# Altium schematic sheet power_supply.SchDoc
size A4; DocumentNumber: 1; SheetNumber: 1; SheetTotal: 2
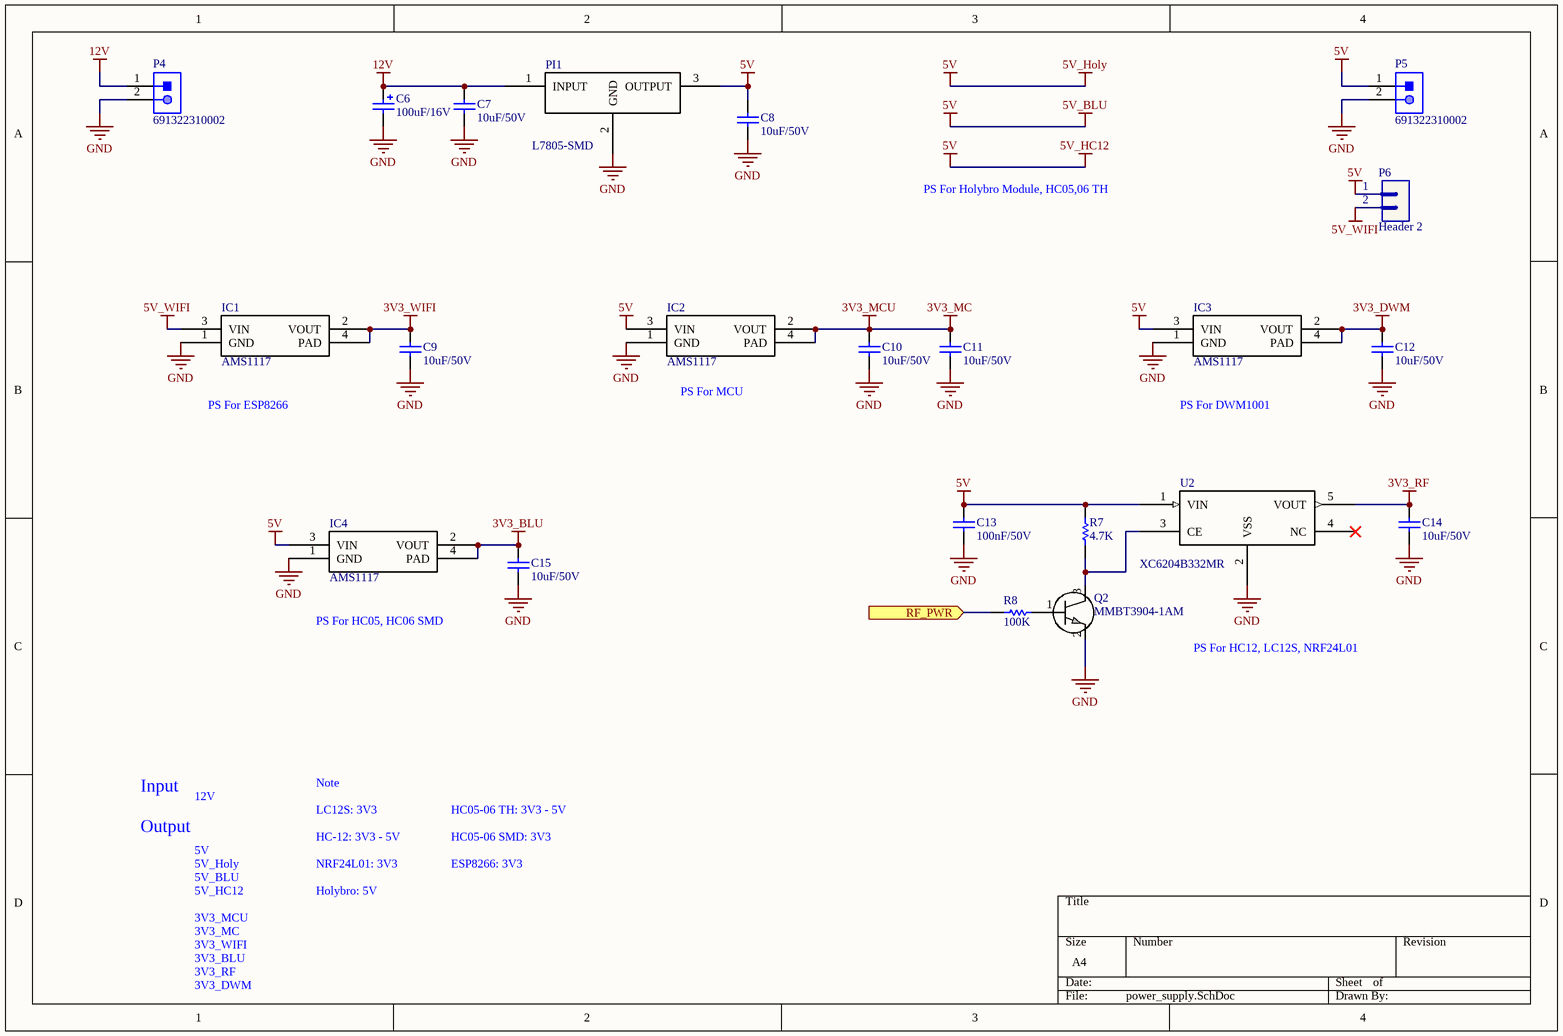
[diagram p0: power_supply.SchDoc]

## Parts
C6  value 100uF/16V  [CAP-SM-AL-SIZE-D-D6L6]  (hidden comment: Cap-Al-100uF-16V-D6L5)
C7  value 10uF/50V  [CAP-SM-0805]  (hidden comment: Cap-10uF-50V-0805)
C8  value 10uF/50V  [CAP-SM-0805]  (hidden comment: Cap-10uF-50V-0805)
C9  value 10uF/50V  [CAP-SM-0805]  (hidden comment: Cap-10uF-50V-0805)
C10  value 10uF/50V  [CAP-SM-0805]  (hidden comment: Cap-10uF-50V-0805)
C11  value 10uF/50V  [CAP-SM-0805]  (hidden comment: Cap-10uF-50V-0805)
C12  value 10uF/50V  [CAP-SM-0805]  (hidden comment: Cap-10uF-50V-0805)
C13  value 100nF/50V  [CAP-SM-0805]  (hidden comment: Cap-100nF-50V-0805)
C14  value 10uF/50V  [CAP-SM-0805]  (hidden comment: Cap-10uF-50V-0805)
C15  value 10uF/50V  [CAP-SM-0805]  (hidden comment: Cap-10uF-50V-0805)
IC1  AMS1117  [SOT223_AMS111700]
IC2  AMS1117  [SOT223_AMS111700]
IC3  AMS1117  [SOT223_AMS111700]
IC4  AMS1117  [SOT223_AMS111700]
P4  691322310002  [691322310002]
P5  691322310002  [691322310002]
P6  Header 2  [JP2]
PI1  L7805-SMD  [D2PAK]
Q2  MMBT3904-1AM  [SOT23_NEX]
R7  value 4.7K  [RES-SM-0805]  (hidden comment: Res-4.7K-0805)
R8  value 100K  [RES-SM-0805]  (hidden comment: Res-100K-0805)
U2  XC6204B332MR  [XC6204/05_SOT-25]

## Ports
RF_PWR (in)

## Nets
3V3_BLU: C15.2 IC4.2(VOUT) IC4.4(PAD)
3V3_DWM: C12.2 IC3.2(VOUT) IC3.4(PAD)
3V3_MC: C10.2 C11.2 IC2.2(VOUT) IC2.4(PAD)  [also labelled 3V3_MCU]
3V3_RF: C14.2 U2.5(VOUT)
3V3_WIFI: C9.2 IC1.2(VOUT) IC1.4(PAD)
5V: C8.2 C13.2 IC2.3(VIN) IC3.3(VIN) IC4.3(VIN) P5.1 P6.1 PI1.3(OUTPUT) R7.2 U2.1(VIN)  [also labelled 5V_BLU, 5V_HC12, 5V_Holy]
5V_WIFI: IC1.3(VIN) P6.2
12V: C6.1 C7.2 P4.1 PI1.1(INPUT)
GND: C6.2 C7.1 C8.1 C9.1 C10.1 C11.1 C12.1 C13.1 C14.1 C15.1 IC1.1(GND) IC2.1(GND) IC3.1(GND) IC4.1(GND) P4.2 P5.2 PI1.2(GND) Q2.2 U2.2(VSS)
RF_PWR: R8.1 ; port RF_PWR
NetQ2_1: Q2.1 R8.2
NetQ2_3: Q2.3 R7.1 U2.3(CE)

Not connected (* = marked no-connect by the designer): U2 4(NC)*

## Notes on the sheet
- PS For Holybro Module, HC05,06 TH
- PS For ESP8266
- (near IC2) PS For MCU
- PS For DWM1001
- PS For HC05, HC06 SMD
- PS For HC12, LC12S, NRF24L01
- Note
- Input
- Output
- 12V
- LC12S: 3V3
- HC-12: 3V3 - 5V
- HC05-06 TH: 3V3 - 5V
- HC05-06 SMD: 3V3
- 5V
  5V_Holy
  5V_BLU
  5V_HC12
- NRF24L01: 3V3
- Holybro: 5V
- ESP8266: 3V3
- 3V3_MCU
  3V3_MC
  3V3_WIFI
  3V3_BLU
  3V3_RF
  3V3_DWM

## Library data of the parts
C6 = Cap-Al-100uF-16V-D6L5: CAP ALUM 100UF 20% 16V SMD; Manufacturer: Nichicon; Manufacturer Part Number: UWX1C101MCL1GB; Local Supplier: thegioiic; Local Supplier Link: https://thegioiic.com/products/tu-nhom-smd-100uf-16v-d6-3l5-4; Supplier 1: Digikey; Supplier 1 Part Number: 493-2105-1-ND; Supplier 1 Link: https://www.digikey.com/product-detail/en/nichicon/UWX1C101MCL1GB/493-2105-1-ND/590080
C7-C12 C14 C15 = Cap-10uF-50V-0805: CAP CER 10UF 50V X5R 0805; Manufacturer: Yageo; Manufacturer Part Number: CC0805KKX5R9BB106; Local Supplier: thegioiic; Local Supplier Link: https://thegioiic.com/products/tu-10uf-50v-0805; Supplier 1: Digikey; Supplier 1 Link: https://www.digikey.com/product-detail/en/yageo/CC0805KKX5R9BB106/311-3499-2-ND/7164383; Supplier 1 Part Number: 311-3499-2-ND
C13 = Cap-100nF-50V-0805: CAP CER 0.1UF 50V Y5V 0805; Manufacturer: Samsung Electro-Mechanics; Manufacturer Part Number: CL21F104ZBCNNNC; Local Supplier: thegioiic; Local Supplier Link: https://thegioiic.com/products/tu-100nf-0-1uf-50v-0805; Supplier 1: Digikey; Supplier 1 Part Number: 1276-1007-1-ND; Supplier 1 Link: https://www.digikey.com/product-detail/en/samsung-electro-mechanics/CL21F104ZBCNNNC/1276-1007-1-ND/3889093
IC1-IC4 = AMS1117: Manufacturer_Part_Number: AMS1117-5.0; SourceLibrary: Advanced_Monolithic_Systems_2020-02-13; Built_By: EMA_Kyle; Vendor: Advanced Monolithic Systems; Copyright: Copyright (C) 2018 Accelerated Designs. All rights reserved; RefDes: RefDes; Type: DEV
P4 P5 = 691322310002: WR-TBL Serie 322 Horizontal PCB Header, Pluggable, pitch 3.81mm, 2p; Compliance: RoHS; Modularity: No; Pin Number: 2; Rated Current [UL]: 10A; Working Voltage [UL]: 300VAC; ComponentLink1Description: Manufacturer; ComponentLink1URL: http://www.we-online.de; ComponentLink2URL: https://katalog.we-online.de/em/datasheet/691322310002.pdf; ComponentLink2Description: Datasheet; Mounting Technology: THT; Part Number: 691322310002; Packaging: Box; Operating Temperature: -40 to +105degC; PCB/Cable/Panel: PCB; Pitch: 3.81mm; Published Date: October 2019; Type: Horizontal; Publisher: Wurth Elektronik; Application: Pluggable
P6 = Header 2: Header, 2-Pin; LatestRevisionDate: 17-Jul-2002; LatestRevisionNote: Re-released for DXP Platform.; Publisher: Altium Limited
PI1 = L7805-SMD: Manufacturer_Part_Number: L7805CD2T-TR; Vendor: STMicroelectronics; Built_By: EMA_UL_Team; Copyright: Copyright (C) 2018 Accelerated Designs. All rights reserved; RefDes: RefDes; Type: DEV
Q2 = MMBT3904-1AM: Vendor: Nexperia; SourceLibrary: Nexperia_2018-05-2018; Type: DEV; Manufacturer_Part_Number: MMBT3904; Copyright: Copyright (C) 2016 Accelerated Designs. All rights reserved; RefDes: RefDes
R7 = Res-4.7K-0805: RES SMD 4.7K OHM 5% 1/8W 0805; Manufacturer: Yageo; Manufacturer Part Number: RC0805JR-074K7L; Local Supplier: thegioiic; Local Supplier Link: https://thegioiic.com/products/dien-tro-4-7k-ohm-0805-5; Supplier 1: Digikey; Supplier 1 Link: https://www.digikey.com/product-detail/en/yageo/RC0805JR-074K7L/311-4.7KARCT-ND/731274; Supplier 1 Part Number: 311-4.7KARCT-ND
R8 = Res-100K-0805: RES 0 OHM JUMPER 0805; Manufacturer: Vishay Dale; Manufacturer Part Number: WSL080500000ZEA9; Local Supplier: thegioiic; Local Supplier Link: https://thegioiic.com/products/dien-tro-0-ohm-0805-5; Supplier 1: Digikey; Supplier 1 Link: https://www.digikey.com/product-detail/en/vishay-dale/WSL080500000ZEA9/541-3928-1-ND/7423223; Supplier 1 Part Number: 541-3928-1-ND
U2 = XC6204B332MR: Vendor: Torex Semiconductor; Built_By: EMA_UL_Team; SourceLibrary: Torex_2016-07-05_1; Manufacturer_Part_Number: XC6204B332MR; Copyright: Copyright (C) 2018 Accelerated Designs. All rights reserved; RefDes: RefDes; Type: DEV